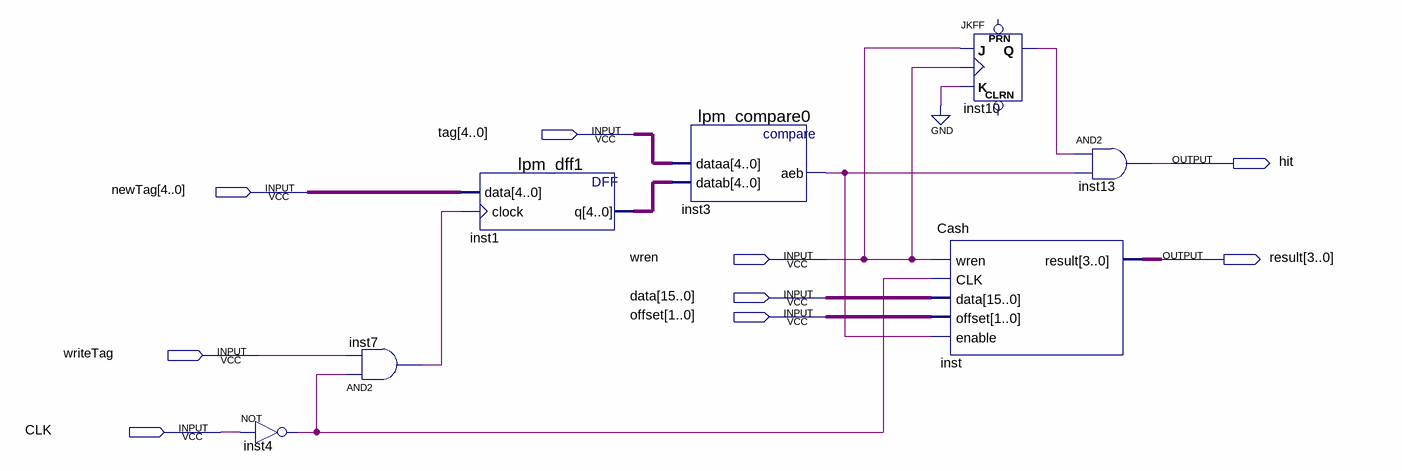
[diagram p0: schematic sheet]
// Quartus schematic CashBank.bdf as structural Verilog: 7 symbols, 9 pins
module CashBank (
  input  [4:0] tag,
  input  [4:0] newTag,
  input  wren,
  input  [15:0] data,
  input  [1:0] offset,
  input  writeTag,
  input  CLK,
  output hit,
  output [3:0] result
);

  wire inst3_aeb, inst4_out, inst7_out, inst10_q;
  wire [4:0] inst1_q;

  not inst4 (inst4_out, CLK);
  and inst7 (inst7_out, inst4_out, writeTag);
  lpm_dff1 inst1 (.data(newTag), .clock(inst7_out), .q(inst1_q));
  lpm_compare0 inst3 (.dataa(tag), .datab(inst1_q), .aeb(inst3_aeb));
  JKFF inst10 (.K(1'b0), .J(wren), .CLK(wren), .Q(inst10_q));  // open: PRN, CLRN
  Cash inst (.wren(wren), .CLK(inst4_out), .data(data), .offset(offset), .enable(inst3_aeb), .result(result));
  and inst13 (hit, inst10_q, inst3_aeb);
endmodule
